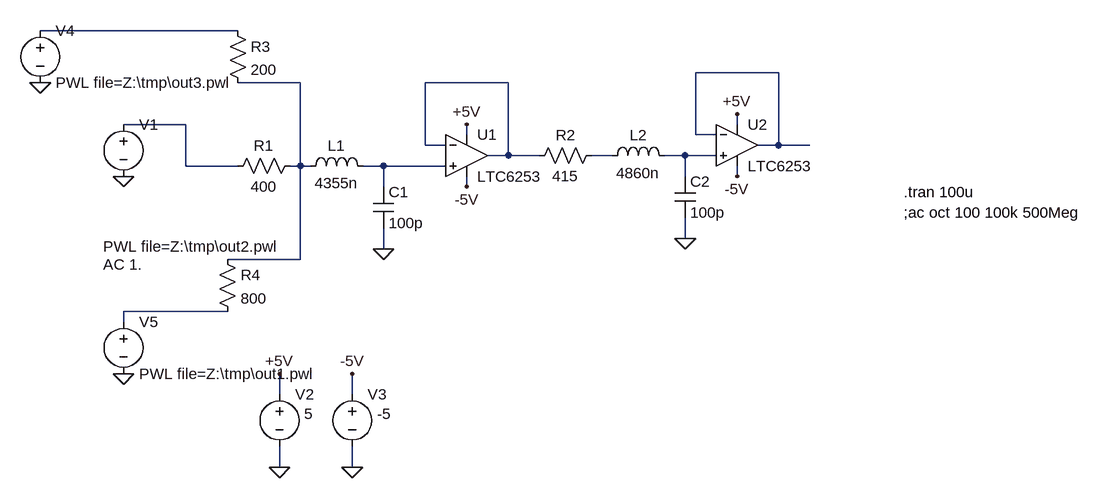
[diagram p0: schematic MASH.3bit.asc]
MASH.3bit.asc, the LTspice schematic file:
Version 4
SHEET 1 1696 680
WIRE 256 -160 -48 -160
WIRE 1088 -96 960 -96
WIRE 352 -80 256 -80
WIRE 672 -80 544 -80
WIRE 176 -16 80 -16
WIRE 1024 -16 1024 -32
WIRE 608 0 608 -16
WIRE 960 0 960 -96
WIRE 992 0 960 0
WIRE 544 16 544 -80
WIRE 576 16 544 16
WIRE 1088 16 1088 -96
WIRE 1088 16 1056 16
WIRE 1136 16 1088 16
WIRE 672 32 672 -80
WIRE 672 32 640 32
WIRE 720 32 672 32
WIRE 832 32 800 32
WIRE 944 32 912 32
WIRE 992 32 944 32
WIRE 176 48 176 -16
WIRE 256 48 176 48
WIRE 352 48 352 -80
WIRE 352 48 336 48
WIRE 368 48 352 48
WIRE 480 48 448 48
WIRE 576 48 480 48
WIRE 944 64 944 32
WIRE 1024 64 1024 48
WIRE 480 80 480 48
WIRE 608 80 608 64
WIRE 944 160 944 128
WIRE 480 176 480 144
WIRE 352 192 352 48
WIRE 352 192 240 192
WIRE 240 272 80 272
WIRE 80 288 80 272
WIRE 320 400 320 368
WIRE 432 400 432 368
WIRE 320 512 320 480
WIRE 432 512 432 480
FLAG 480 176 0
FLAG 944 160 0
FLAG 608 -16 +5V
FLAG 608 80 -5V
FLAG 1024 -32 +5V
FLAG 1024 64 -5V
FLAG 320 512 0
FLAG 320 368 +5V
FLAG 432 512 0
FLAG 432 368 -5V
FLAG 80 64 0
FLAG 80 368 0
FLAG -48 -80 0
SYMBOL voltage 80 -32 R0
WINDOW 123 -31 232 Left 2
WINDOW 39 -31 260 Left 2
WINDOW 3 -31 204 Left 2
SYMATTR Value2 AC 1.
SYMATTR Value PWL file=Z:\tmp\out2.pwl
SYMATTR InstName V1
SYMBOL res 352 32 R90
WINDOW 0 0 56 VBottom 2
WINDOW 3 32 56 VTop 2
SYMATTR InstName R1
SYMATTR Value 400
SYMBOL ind 352 64 R270
WINDOW 0 32 56 VTop 2
WINDOW 3 5 56 VBottom 2
SYMATTR InstName L1
SYMATTR Value 4355n
SYMBOL cap 464 80 R0
SYMATTR InstName C1
SYMATTR Value 100p
SYMBOL res 816 16 R90
WINDOW 0 0 56 VBottom 2
WINDOW 3 32 56 VTop 2
SYMATTR InstName R2
SYMATTR Value 415
SYMBOL ind 816 48 R270
WINDOW 0 32 56 VTop 2
WINDOW 3 5 56 VBottom 2
SYMATTR InstName L2
SYMATTR Value 4860n
SYMBOL cap 928 64 R0
SYMATTR InstName C2
SYMATTR Value 100p
SYMBOL voltage 320 384 R0
WINDOW 123 0 0 Left 2
WINDOW 39 0 0 Left 2
WINDOW 3 38 46 Left 2
SYMATTR Value 5
SYMATTR InstName V2
SYMBOL voltage 432 384 R0
WINDOW 123 0 0 Left 2
WINDOW 39 0 0 Left 2
WINDOW 3 38 46 Left 2
SYMATTR Value -5
SYMATTR InstName V3
SYMBOL Opamps\\LTC6253 608 32 R0
SYMATTR InstName U1
SYMBOL Opamps\\LTC6253 1024 16 R0
SYMATTR InstName U2
SYMBOL voltage -48 -176 R0
WINDOW 123 0 0 Left 2
WINDOW 39 0 0 Left 2
SYMATTR InstName V4
SYMATTR Value PWL file=Z:\tmp\out3.pwl
SYMBOL voltage 80 272 R0
WINDOW 123 0 0 Left 2
WINDOW 39 0 0 Left 2
SYMATTR InstName V5
SYMATTR Value PWL file=Z:\tmp\out1.pwl
SYMBOL res 240 -176 R0
SYMATTR InstName R3
SYMATTR Value 200
SYMBOL res 224 176 R0
SYMATTR InstName R4
SYMATTR Value 800
TEXT 1280 88 Left 2 !.tran 100u
TEXT 1280 120 Left 2 !;ac oct 100 100k 500Meg

The netlist it stands for:
* MASH.3bit.asc
V1 N005 0 PWL file=Z:\tmp\out2.pwl AC 1.
R1 N003 N005 400
L1 N003 N008 4355n
C1 N008 0 100p
R2 N006 N004 415
L2 N006 N007 4860n
C2 N007 0 100p
V2 +5V 0 5
V3 -5V 0 -5
* U1: LTC6253 (symbol Opamps\LTC6253 not available, pins judged from their places): In+=N008 In-=N004 V+=+5V V-=-5V OUT=N004
* U2: LTC6253 (symbol Opamps\LTC6253 not available, pins judged from their places): In+=N007 In-=N002 V+=+5V V-=-5V OUT=N002
V4 N001 0 PWL file=Z:\tmp\out3.pwl
V5 N009 0 PWL file=Z:\tmp\out1.pwl
R3 N001 N003 200
R4 N003 N009 800
.tran 100u
;ac oct 100 100k 500Meg
.backanno
.end